# Altium schematic sheet SCH_WINGLET_DISP.SchDoc: Winglet LCD Display
size B; DrawnBy: HCAdam; Organization: Aerospace Village; DocumentNumber: WINGLET; Revision: A; SheetNumber: 5; SheetTotal: 10
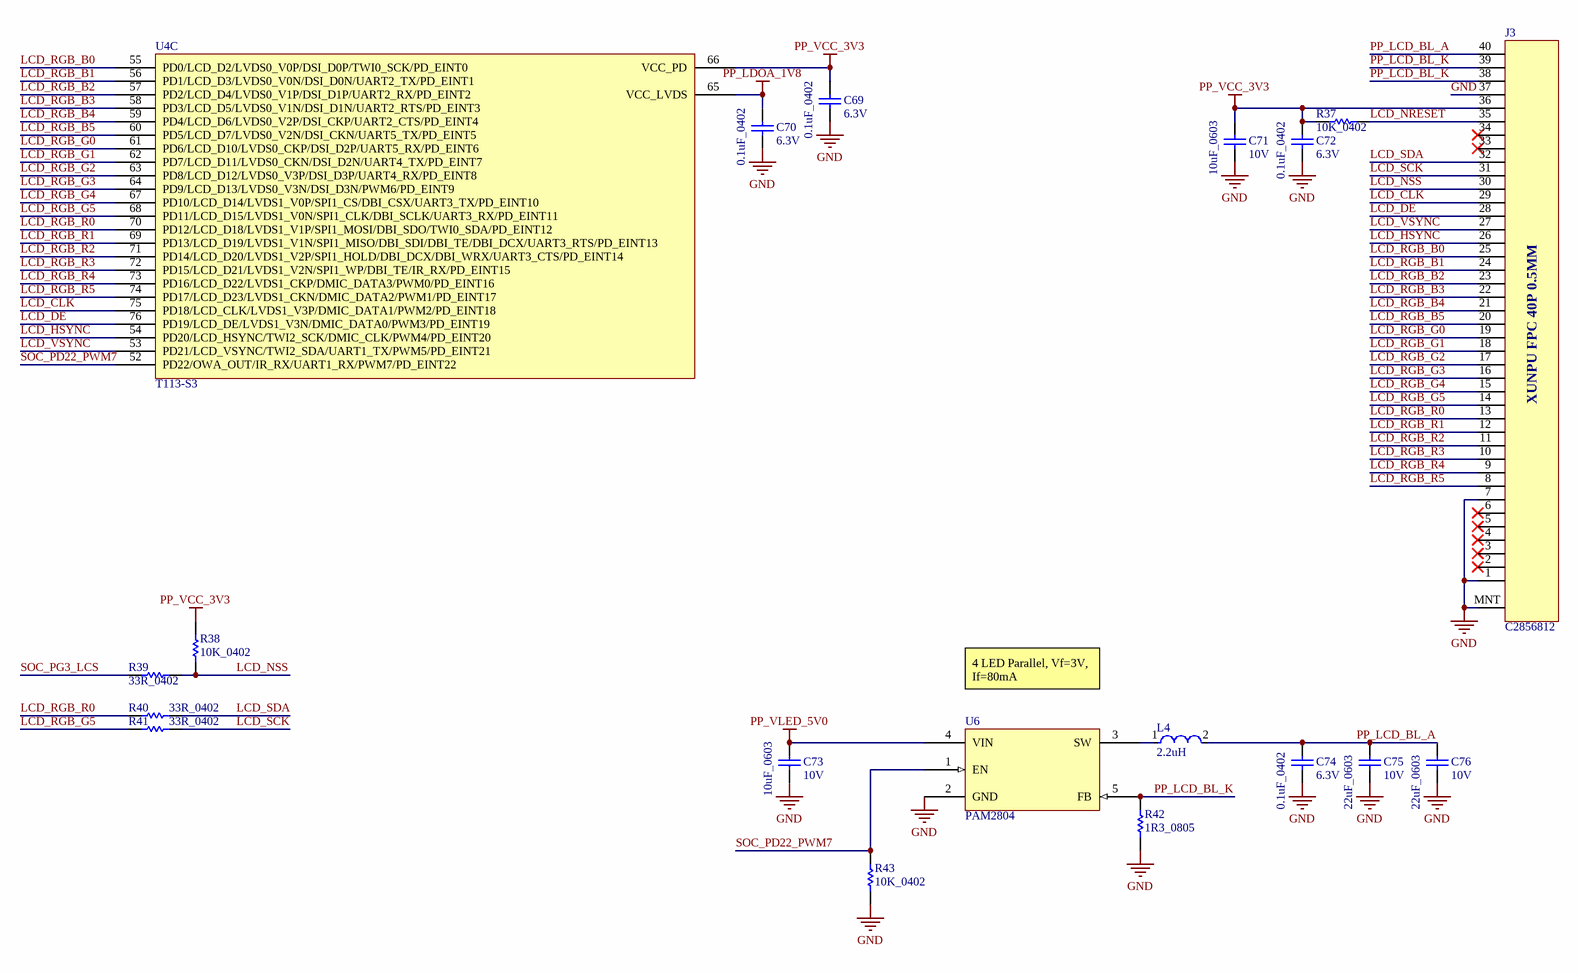
[diagram p0: SCH_WINGLET_DISP.SchDoc]

## Parts
C69  0.1uF_0402  Voltage Rating: 6.3V  [CAPC1005X56X25NL10T15]
C70  0.1uF_0402  Voltage Rating: 6.3V  [CAPC1005X56X25NL10T15]
C71  10uF_0603  Voltage Rating: 10V  [CAPC1609X100X15NL20]
C72  0.1uF_0402  Voltage Rating: 6.3V  [CAPC1005X56X25NL10T15]
C73  10uF_0603  Voltage Rating: 10V  [CAPC1609X100X15NL20]
C74  0.1uF_0402  Voltage Rating: 6.3V  [CAPC1005X56X25NL10T15]
C75  22uF_0603  Voltage Rating: 10V  [CAPC1608X100X20NL10]
C76  22uF_0603  Voltage Rating: 10V  [CAPC1608X100X20NL10]
J3  C2856812  [LCSC_FPC_40P_0P5MM]
L4  2.2uH  [FP-NR3015-MFG]
R37  10K_0402  [RESC1005X40X25NL05T05]
R38  10K_0402  [RESC1005X40X25NL05T05]
R39  33R_0402  [RESC1005X40X25NL05T05]
R40  33R_0402  [RESC1005X40X25NL05T05]
R41  33R_0402  [RESC1005X40X25NL05T05]
R42  1R3_0805  [RESC2013X50X30NL20T20]
R43  10K_0402  [RESC1005X40X25NL05T05]
U4  T113-S3  [TSQFP40P1600X1600X160_HS-129N]  (part C of 7)
U6  PAM2804  [SOT95P292X115-5N]

## Nets
GND: C69.1 C70.1 C71.1 C72.1 C73.1 C74.1 C75.1 C76.1 J3.1 J3.7 J3.37 J3.MNT R42.1 R43.2 U6.2(GND)
PP_LDOA_1V8: C70.2 U4.65(VCC_LVDS)
PP_VCC_3V3: C69.2 C71.2 C72.2 J3.36 R37.1 R38.1 U4.66(VCC_PD)
PP_VLED_5V0: C73.2 U6.4(VIN)
LCD_CLK: J3.29 U4.75(PD18/LCD_CLK/LVDS1_V3P/DMIC_DATA1/PWM2/PD_EINT18)
LCD_DE: J3.28 U4.76(PD19/LCD_DE/LVDS1_V3N/DMIC_DATA0/PWM3/PD_EINT19)
LCD_HSYNC: J3.26 U4.54(PD20/LCD_HSYNC/TWI2_SCK/DMIC_CLK/PWM4/PD_EINT20)
LCD_NRESET: J3.35 R37.2
LCD_NSS: J3.30 R38.2 R39.2
LCD_RGB_B0: J3.25 U4.55(PD0/LCD_D2/LVDS0_V0P/DSI_D0P/TWI0_SCK/PD_EINT0)
LCD_RGB_B1: J3.24 U4.56(PD1/LCD_D3/LVDS0_V0N/DSI_D0N/UART2_TX/PD_EINT1)
LCD_RGB_B2: J3.23 U4.57(PD2/LCD_D4/LVDS0_V1P/DSI_D1P/UART2_RX/PD_EINT2)
LCD_RGB_B3: J3.22 U4.58(PD3/LCD_D5/LVDS0_V1N/DSI_D1N/UART2_RTS/PD_EINT3)
LCD_RGB_B4: J3.21 U4.59(PD4/LCD_D6/LVDS0_V2P/DSI_CKP/UART2_CTS/PD_EINT4)
LCD_RGB_B5: J3.20 U4.60(PD5/LCD_D7/LVDS0_V2N/DSI_CKN/UART5_TX/PD_EINT5)
LCD_RGB_G0: J3.19 U4.61(PD6/LCD_D10/LVDS0_CKP/DSI_D2P/UART5_RX/PD_EINT6)
LCD_RGB_G1: J3.18 U4.62(PD7/LCD_D11/LVDS0_CKN/DSI_D2N/UART4_TX/PD_EINT7)
LCD_RGB_G2: J3.17 U4.63(PD8/LCD_D12/LVDS0_V3P/DSI_D3P/UART4_RX/PD_EINT8)
LCD_RGB_G3: J3.16 U4.64(PD9/LCD_D13/LVDS0_V3N/DSI_D3N/PWM6/PD_EINT9)
LCD_RGB_G4: J3.15 U4.67(PD10/LCD_D14/LVDS1_V0P/SPI1_CS/DBI_CSX/UART3_TX/PD_EINT10)
LCD_RGB_G5: J3.14 R41.1 U4.68(PD11/LCD_D15/LVDS1_V0N/SPI1_CLK/DBI_SCLK/UART3_RX/PD_EINT11)
LCD_RGB_R0: J3.13 R40.1 U4.70(PD12/LCD_D18/LVDS1_V1P/SPI1_MOSI/DBI_SDO/TWI0_SDA/PD_EINT12)
LCD_RGB_R1: J3.12 U4.69(PD13/LCD_D19/LVDS1_V1N/SPI1_MISO/DBI_SDI/DBI_TE/DBI_DCX/UART3_RTS/PD_EINT13)
LCD_RGB_R2: J3.11 U4.71(PD14/LCD_D20/LVDS1_V2P/SPI1_HOLD/DBI_DCX/DBI_WRX/UART3_CTS/PD_EINT14)
LCD_RGB_R3: J3.10 U4.72(PD15/LCD_D21/LVDS1_V2N/SPI1_WP/DBI_TE/IR_RX/PD_EINT15)
LCD_RGB_R4: J3.9 U4.73(PD16/LCD_D22/LVDS1_CKP/DMIC_DATA3/PWM0/PD_EINT16)
LCD_RGB_R5: J3.8 U4.74(PD17/LCD_D23/LVDS1_CKN/DMIC_DATA2/PWM1/PD_EINT17)
LCD_SCK: J3.31 R41.2
LCD_SDA: J3.32 R40.2
LCD_VSYNC: J3.27 U4.53(PD21/LCD_VSYNC/TWI2_SDA/UART1_TX/PWM5/PD_EINT21)
PP_LCD_BL_A: C74.2 C75.2 C76.2 J3.40 L4.2
PP_LCD_BL_K: J3.38 J3.39 R42.2 U6.5(FB)
SOC_PD22_PWM7: R43.1 U4.52(PD22/OWA_OUT/IR_RX/UART1_RX/PWM7/PD_EINT22) U6.1(EN)
SOC_PG3_LCS: R39.1
NetL4_1: L4.1 U6.3(SW)

Not connected (* = marked no-connect by the designer): J3 2* 3* 4* 5* 6* 33* 34*

## Notes on the sheet
- 4 LED Parallel, Vf=3V, If=80mA
- Title
- Size:
- Date:
- B
- Project:
- Revision:
- Sheet
- of
- Drawn By:
- (in symbol FPC-05F-40PH20) XUNPU FPC 40P 0.5MM

## Library data of the parts
C69 C70 C72 C74 = CMP-2008-02743-1: 04026D104KAT2A; Manufacturer: AVX Interconnect / Elco; Part Number: 04026D104KAT2A
C71 C73 = CMP-2006-00191-1: Part Number: TACL106M006XTA; Manufacturer: AVX Interconnect / Elco
C75 C76 = CMP-2000-05441-1: Chip Capacitor, 22 uF, +/- 20%, 10 V, -55 to 85 degC, 0603 (1608 Metric), RoHS, Tape and Reel / PN: C1608X5R1A226M080AC; Manufacturer: TDK; PCN Part Number: MLCCPartNumberChange30/Nov/2012; Product Training Modules: CSeriesGeneralApplicationsSEAT,CCV,andTVCLDesignToolsGuidetoReplacinganElectrolyticCapacitorwithanMLCC; Other Names: 445-9077-1; Design Resources: 20WNon-IsolatedBuckLEDDriverUsingPLLNK460KG; Online Catalog: CSeries,GeneralPurpose; Capacitance: 22µF; Temperature Coefficient: X5R; Kits: 445-9014-KIT-ND-KITMLCC100PF-22UF060310-50V; Packaging: CutTape(CT); Standard Package: 1; Package / Case: 0603(1608Metric); Lead Style: -; Features: -; Ratings: -; Voltage - Rated: 10V; Operating Temperature: -55degC~85degC; Applications: GeneralPurpose; Package Reference: 603; Datasheet URL: http://download.siliconexpert.com/pdfs/2015/4/21/15/54/45/779/tdk_/manual/37024850441143360mlcc_commercial_general_en.pdf; Datasheet Version: Mar-15; Mounting Type: SurfaceMount,MLCC; Lead Spacing: -; Size / Dimension: 0.063"Lx0.031"W(1.60mmx0.80mm); Height - Seated (Max): -; Package Description: 2-Pin Surface Mount Device, Body 1.6 x 0.8 mm; Manufacturer URL: http://www.tdk.com/; RoHS Information: RoHSCertificate-MLCC; Tolerance: ±20%; Series: C; Thickness (Max): 0.035"(0.90mm); Family: CeramicCapacitors; Category: Capacitors
J3 = FPC-05F-40PH20: XUNPU FPC 40P 0.5MM / C2856812
L4 = CMP-0569-00001-3: SMD Power Inductors 2.2uH ±20% 1.48A 72mΩ / NR3015T2R2M; RMS Current (Irms): 1.5A; Shielding: Shielded; Self Resonant Frequency: 64MHz; Test Frequency: 100kHz; DC Resistance (DCR): 72mR; Core Material: Ferrite; Package Quantity: 1; Current Rating: 1.48A; Height - Seated (Max): 0.059inch; Width: 0.118inch; Inductance Tolerance: 20%; Tolerance: 20%; Resistor Type: Wirewound; RoHS Compliant: Yes; Case/Package: 3015; Length: 0.118inch; Max DC Current: 1.5A; Max Operating Temperature: 120°C; Inductance: 2.2uH; Saturation Current: 1.48A; Min Operating Temperature: -25°C; Height: 1.5mm; Series: NR; Lead Free: Lead Free; Packaging: Tape and Reel; Halogen Free: Halogen Free; Termination: SMD/SMT; Number of Pins: 2
R37 R38 R43 = CMP-2000-07588-1: Chip Resistor, 10 KOhm, +/- 1%, 0.1 W, -55 to 155 degC, 0402 (1005 Metric), RoHS, Tape and Reel / ERJ2RKF1002X; Manufacturer: Panasonic; Power Rating: 100mW; Voltage Rating: 50V; Resistance: 10KOhm; Case\/Package: 0402; Temperature Coefficient: 100ppm\/degreesC; RoHSCompliant: True; Lead Free: LeadFree; Package Quantity: 1; Contact Plating: Tin; Length: 1mm; Radiation Hardening: No; REACH SVHC: NoSVHC; Max Operating Temperature: 155degC; Depth: 0.5mm; Case Code (Imperial): 0402; Military Standard: Not; Package Description: 2-Pin Surface Mount Device, Body 1 x 0.5 mm; Termination: SMD/SMT; Case Code (Metric): 1005; Height: 0.35mm; Packaging: TapeandReel; Voltage Rating (DC): 50V; Package Reference: 402; Number of Pins: 2; Tolerance: 1%; Mounting Technology: SurfaceMount; Width: 0.02inch; Mount: SurfaceMount; Datasheet URL: https://industrial.panasonic.com/cdbs/www-data/pdf/RDA0000/AOA0000C304.pdf; Composition: ThickFilm; Datasheet Version: 02/2017; Manufacturer URL: http://www.panasonic.com/; Max Power Dissipation: 100mW; Number of Terminations: 2; Min Operating Temperature: -55degC
R39-R41 = CMP-2002-01146-1: ERJ2RKF33R0X; Manufacturer: Panasonic; Part Number: ERJ2RKF33R0X
R42 = CMP-2001-03654-1: CRCW08051R30JNEA; Manufacturer: Vishay Dale; Part Number: CRCW08051R30JNEA
U4 = T113-S3: Allwinner Dual-core ARM Cortex-A7 Smart Control and Display SoC
U6 = PAM2804: 1A 1.5MHz STEP-DOWN CONSTANT CURRENT, HIGH EFFICIENCY LED DRIVER